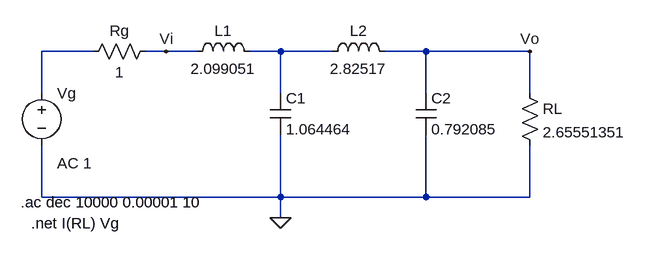
[diagram p0: schematic Circuito_Normalizado.asc]
Circuito_Normalizado.asc, the LTspice schematic file:
Version 4
SHEET 1 932 680
WIRE 96 96 16 96
WIRE 208 96 176 96
WIRE 256 96 208 96
WIRE 384 96 336 96
WIRE 464 96 384 96
WIRE 608 96 544 96
WIRE 768 96 608 96
WIRE 16 160 16 96
WIRE 384 160 384 96
WIRE 608 160 608 96
WIRE 768 160 768 96
WIRE 16 320 16 240
WIRE 384 320 384 224
WIRE 384 320 16 320
WIRE 608 320 608 224
WIRE 608 320 384 320
WIRE 768 320 768 240
WIRE 768 320 608 320
WIRE 384 352 384 320
FLAG 384 352 0
FLAG 208 96 Vi
FLAG 768 96 Vo
SYMBOL voltage 16 144 R0
WINDOW 123 24 124 Left 2
WINDOW 39 0 0 Left 0
SYMATTR Value2 AC 1
SYMATTR InstName Vg
SYMATTR Value ""
SYMBOL res 192 80 R90
WINDOW 0 0 56 VBottom 2
WINDOW 3 32 56 VTop 2
SYMATTR InstName Rg
SYMATTR Value 1
SYMBOL ind 240 112 R270
WINDOW 0 32 56 VTop 2
WINDOW 3 5 56 VBottom 2
SYMATTR InstName L1
SYMATTR Value 2.099051
SYMBOL cap 368 160 R0
SYMATTR InstName C1
SYMATTR Value 1.064464
SYMBOL ind 448 112 R270
WINDOW 0 32 56 VTop 2
WINDOW 3 5 56 VBottom 2
SYMATTR InstName L2
SYMATTR Value 2.82517
SYMBOL cap 592 160 R0
SYMATTR InstName C2
SYMATTR Value 0.792085
SYMBOL res 752 144 R0
SYMATTR InstName RL
SYMATTR Value 2.65551351
TEXT -16 328 Left 2 !.ac dec 10000 0.00001 10
TEXT 0 360 Left 2 !.net I(RL) Vg

The netlist it stands for:
* Circuito_Normalizado.asc
Vg N001 0 AC 1
Rg Vi N001 1
L1 Vi N002 2.099051
C1 N002 0 1.064464
L2 N002 Vo 2.82517
C2 Vo 0 0.792085
RL Vo 0 2.65551351
.ac dec 10000 0.00001 10
.net I(RL) Vg
.backanno
.end